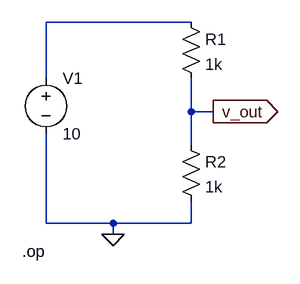
[diagram p0: schematic op.asc]
op.asc, the LTspice schematic file:
Version 4
SHEET 1 880 680
WIRE 272 32 64 32
WIRE 64 112 64 32
WIRE 272 160 272 112
WIRE 304 160 272 160
WIRE 272 208 272 160
WIRE 64 320 64 192
WIRE 160 320 64 320
WIRE 272 320 272 288
WIRE 272 320 160 320
WIRE 160 336 160 320
FLAG 160 336 0
FLAG 304 160 v_out
IOPIN 304 160 Out
SYMBOL voltage 64 96 R0
WINDOW 123 0 0 Left 0
WINDOW 39 0 0 Left 0
SYMATTR InstName V1
SYMATTR Value 10
SYMBOL res 256 16 R0
SYMATTR InstName R1
SYMATTR Value 1k
SYMBOL res 256 192 R0
SYMATTR InstName R2
SYMATTR Value 1k
TEXT 30 360 Left 2 !.op

The netlist it stands for:
* op.asc
V1 N001 0 10
R1 N001 v_out 1k
R2 v_out 0 1k
.op
.backanno
.end